# EasyEDA schematic NANO_Mystical Ouija Board.json
TITLE: Electric Ouija Board V3; REV: A; Date: 2025-11-25; Sheet: 1/1; Drawn By: LSSteele; Company: LSSteele
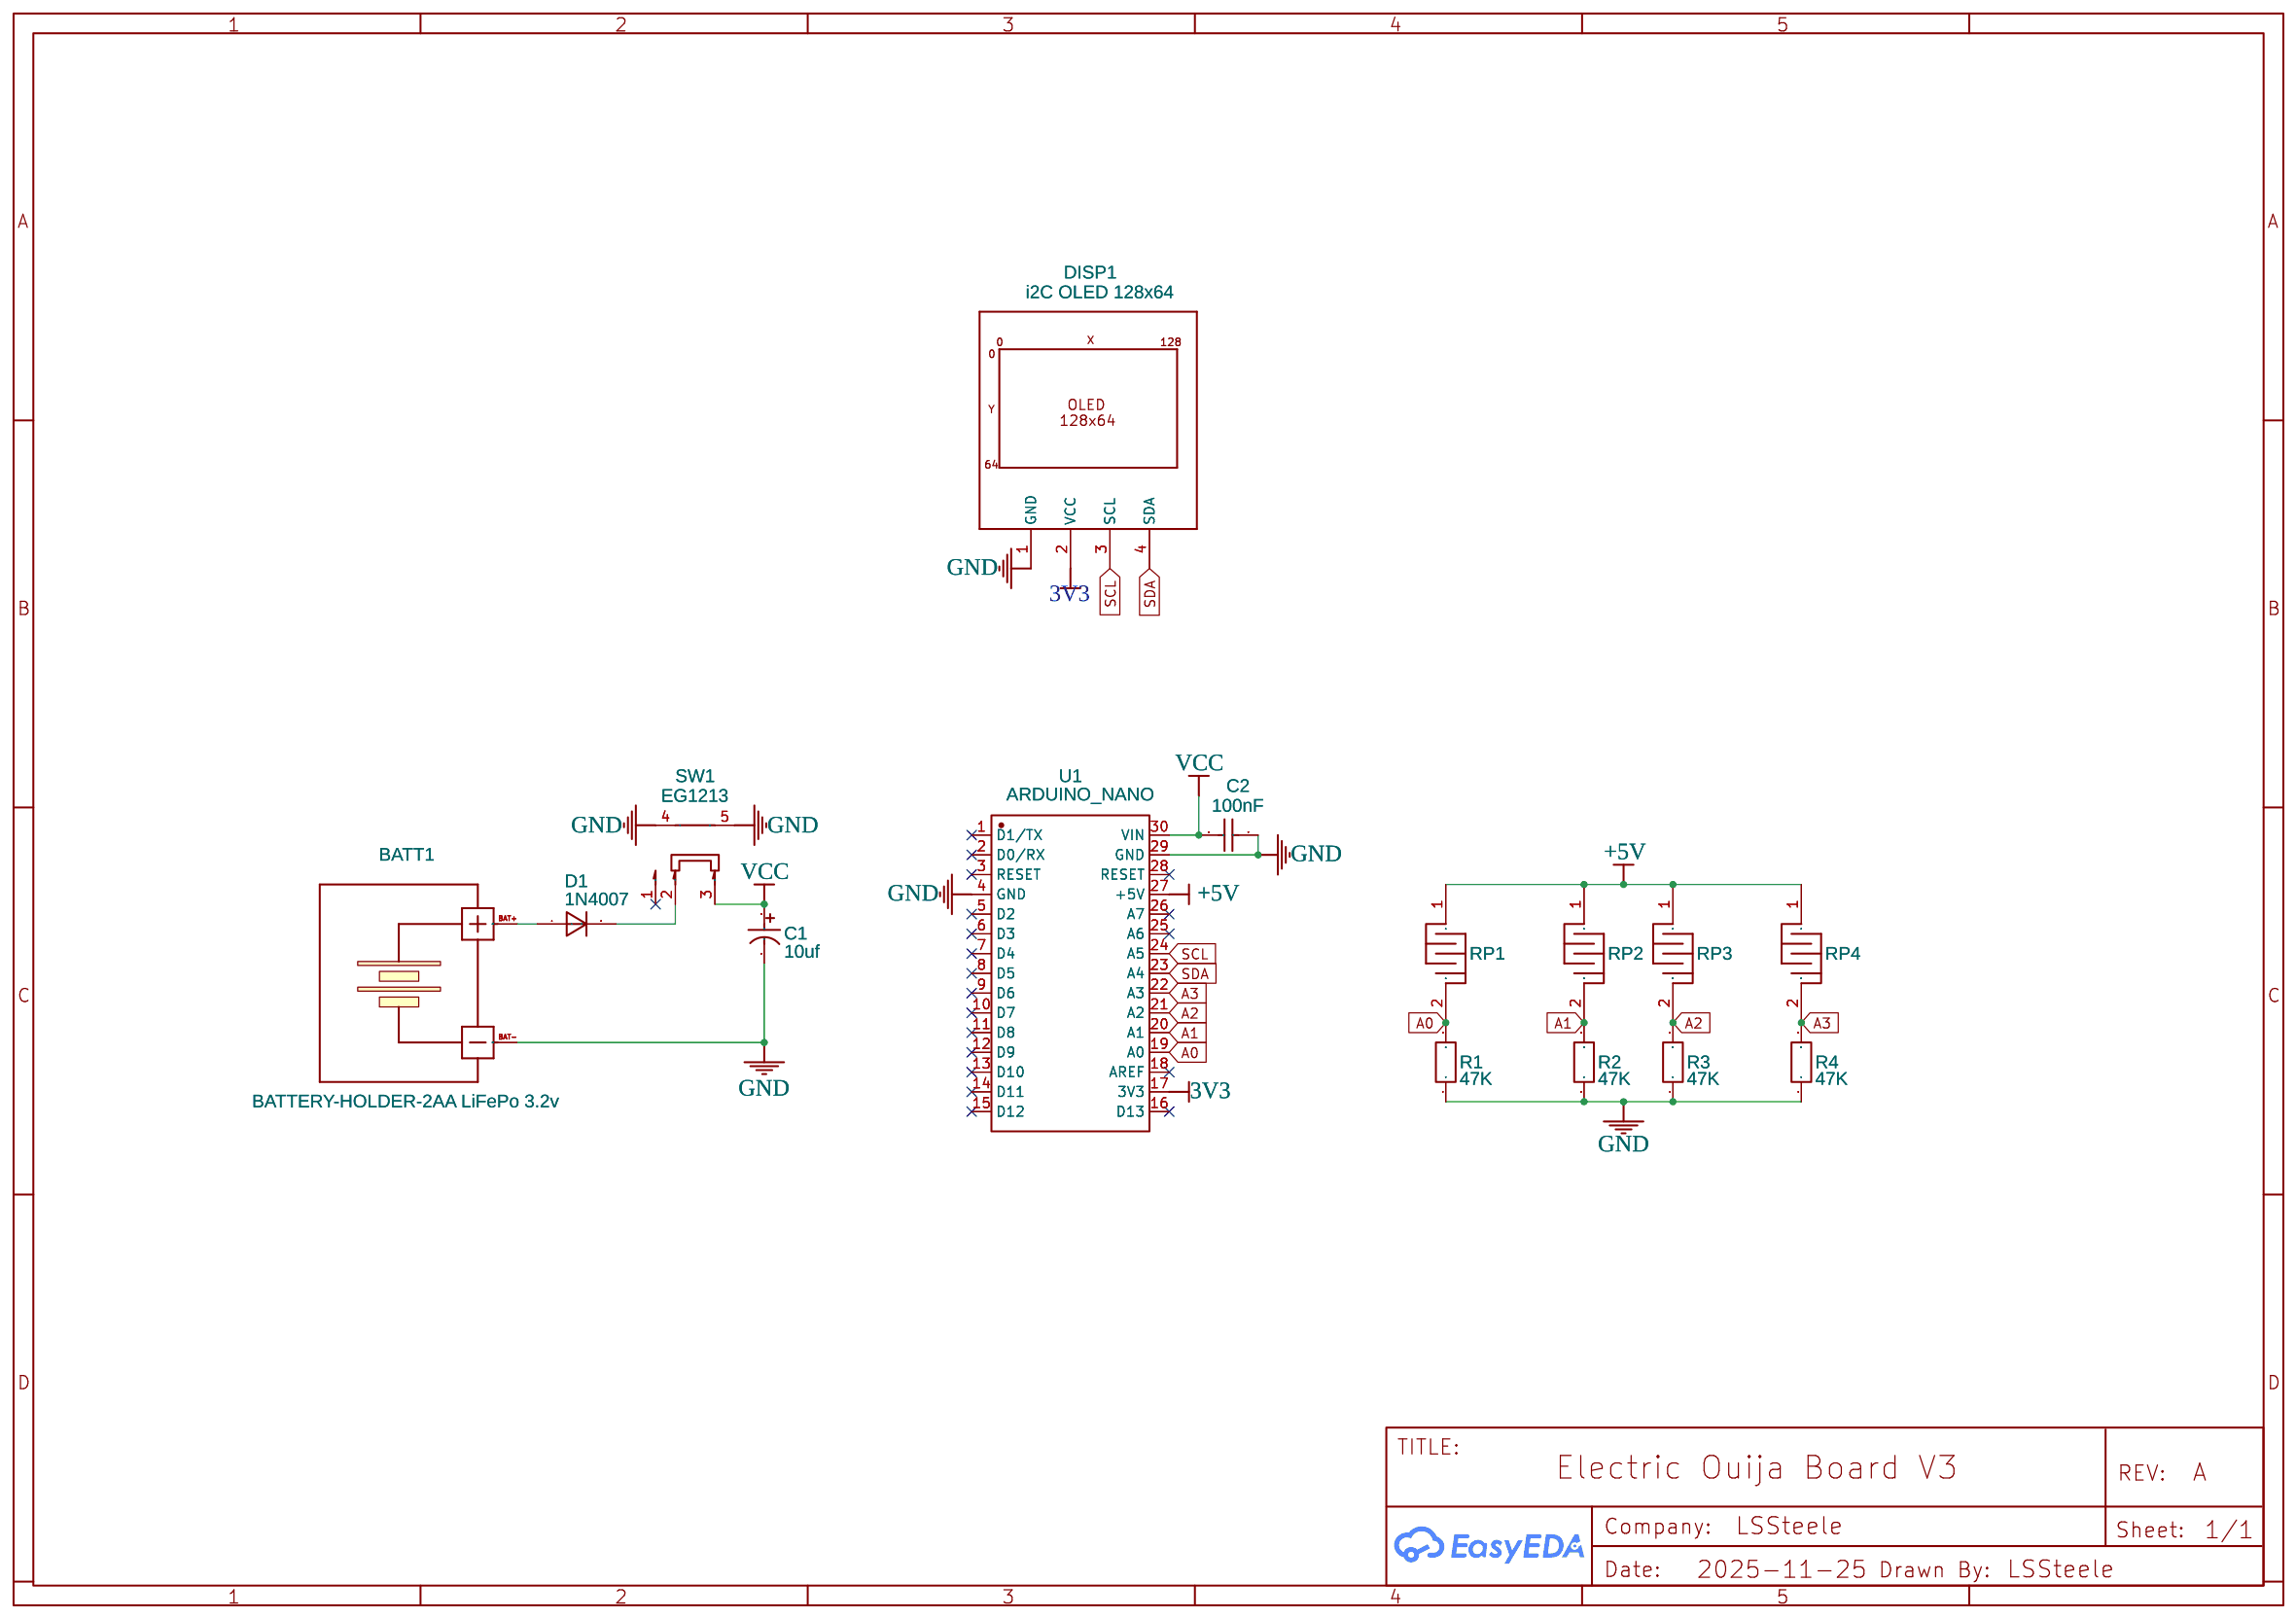
[diagram p0: schematic sheet]

## Parts
BATT1  BATTERY-HOLDER-2AA LiFePo 3.2v  [BATTERY-HOLDER-2AA_CORRECTED]
C1  10uf  [CAP-TH_BD4.0-P1.50-D0.8-FD]
C2  100nF  [100NF]
D1  1N4007  [1N4007]
DISP1  i2C OLED 128x64  [DISPLAY-OLED-128X64-I2C]
R1  47K  [R_1/4W]
R2  47K  [R_1/4W]
R3  47K  [R_1/4W]
R4  47K  [R_1/4W]
RP1  PCB_BUTTON 11MM  [PCB_SWITCH_NEW]
RP2  PCB_BUTTON 11MM  [PCB_SWITCH_NEW]
RP3  PCB_BUTTON 11MM  [PCB_SWITCH_NEW]
RP4  PCB_BUTTON 11MM  [PCB_SWITCH_NEW]
SW1  EG1213  [SW-TH_EG1213]
U1  ARDUINO_NANO  [COMM-TH_ARDUINO_NANO]

## Library data of the parts
BATT1 = BATTERY-HOLDER-2AA: Contributor: SugarFoot Pedals
C1 = Electrolytic Cap Small TH: Supplier: Digi-Key; JLCPCB Part Class: Extended Part; Contributor: VibratoLLC
C2 = 100nF: Supplier: LCSC; Manufacturer: ReliaPro; Manufacturer Part: CT4-0805Y104M500; Contributor: Nassim9; Supplier Part: C46756
D1 = 1N4007_Diode: Contributor: SugarFoot Pedals
DISP1 = i2C OLED 128x64: Contributor: SugarFootProjects
R1-R4 = Resistor 1/4W TH: Manufacturer Part: RD 1/4W 1R J T/B A1; Contributor: VibratoLLC
RP1-RP4 = PCB_BUTTON 11MM: Contributor: SugarFootProjects
SW1 = Power Switch_TH_EG1213: Supplier: LCSC; Supplier Part: C273393; Manufacturer: E-Switch; Contributor: SugarFoot Pedals; JLCPCB Part Class: Extended Part
U1 = ARDUINO_NANO: Contributor: lcsc; Supplier: LCSC; Supplier Part: C9900017879; Manufacturer: null; JLCPCB Part Class: Extended Part

## Nets
3V3: DISP1.2(VCC) U1.17(3V3)
+5V: RP1.1 RP2.1 RP3.1 RP4.1 U1.27(+5V)
GND: BATT1.BAT- C1.2 C2.2 DISP1.1(GND) R1.1 R2.1 R3.1 R4.1 SW1.4 SW1.5 U1.4(GND) U1.29(GND)
VCC: C1.1 C2.1 SW1.3 U1.30(VIN)
A0: R1.2 RP1.2 U1.19(A0)
A1: R2.2 RP2.2 U1.20(A1)
A2: R3.2 RP3.2 U1.21(A2)
A3: R4.2 RP4.2 U1.22(A3)
SCL: DISP1.3(SCL) U1.24(A5)
SDA: DISP1.4(SDA) U1.23(A4)
Net-(BATT1-BAT+): BATT1.BAT+ D1.1(A)
Net-(D1-2): D1.2(K) SW1.2

Not connected (* = marked no-connect by the designer): SW1 1*; U1 1(D1/TX)* 2(D0/RX)* 3(RESET)* 5(D2)* 6(D3)* 7(D4)* 8(D5)* 9(D6)* 10(D7)* 11(D8)* 12(D9)* 13(D10)* 14(D11)* 15(D12)* 16(D13)* 18(AREF)* 25(A6)* 26(A7)* 28(RESET)*
